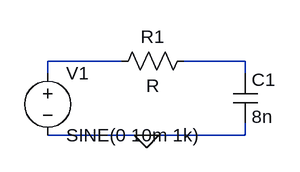
[diagram p0: schematic Draft6.asc]
Draft6.asc, the LTspice schematic file:
Version 4.1
SHEET 1 880 680
WIRE 112 128 16 128
WIRE 272 128 192 128
WIRE 16 144 16 128
WIRE 272 144 272 128
WIRE 144 224 16 224
WIRE 272 224 272 208
WIRE 272 224 144 224
FLAG 144 224 0
SYMBOL res 208 112 R90
WINDOW 0 0 56 VBottom 2
WINDOW 3 32 56 VTop 2
SYMATTR InstName R1
SYMBOL cap 256 144 R0
SYMATTR InstName C1
SYMATTR Value 8n
SYMBOL voltage 16 128 R0
WINDOW 123 0 0 Left 0
WINDOW 39 0 0 Left 0
SYMATTR InstName V1
SYMATTR Value SINE(0 10m 1k)

The netlist it stands for:
* Draft6.asc
R1 N002 N001 R
C1 N002 0 8n
V1 N001 0 SINE(0 10m 1k)
.backanno
.end